# Altium schematic sheet oscillators.SchDoc
size A
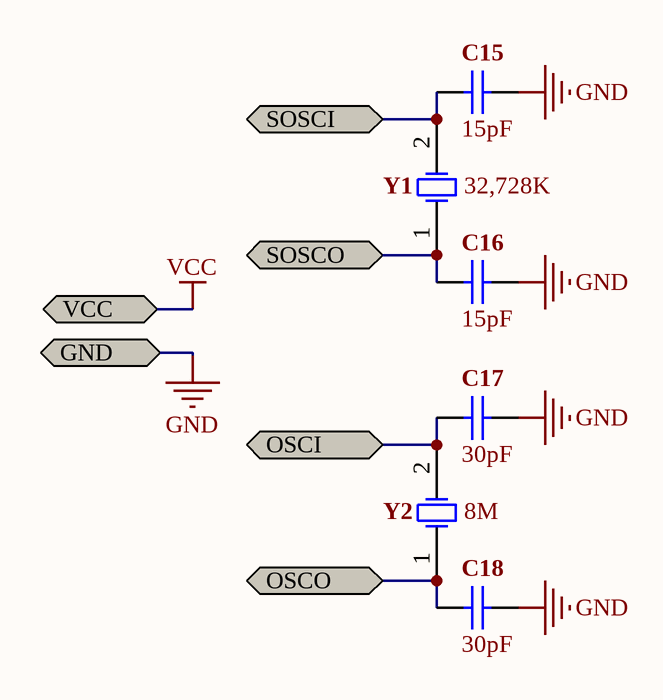
[diagram p0: oscillators.SchDoc]

## Parts
C15  value 15pF  [1608[0603]]  (hidden comment: Cap)
C16  value 15pF  [1608[0603]]  (hidden comment: Cap)
C17  value 30pF  [1608[0603]]  (hidden comment: Cap)
C18  value 30pF  [1608[0603]]  (hidden comment: Cap)
Y1  32,728K  [BCY-W2/D3.1]
Y2  8M  [49_SMD_8Mhz]

## Ports
GND, OSCI, OSCO, SOSCI, SOSCO, VCC

## Nets
GND: C15.1 C16.1 C17.1 C18.1 ; port GND
VCC: port VCC
OSCI: C17.2 Y2.2(OSC2) ; port OSCI
OSCO: C18.2 Y2.1(OSC1) ; port OSCO
SOSCI: C15.2 Y1.2(OSC2) ; port SOSCI
SOSCO: C16.2 Y1.1(OSC1) ; port SOSCO

## Library data of the parts
C15-C18 = Cap: Capacitor; Published: 8-Jun-2000; LatestRevisionDate: 17-Jul-2002; LatestRevisionNote: Re-released for DXP Platform.; PackageReference: RAD-0.3; Publisher: Altium Limited; PackageDescription: Radial Cap, Thru-Hole; 2 Leads; 0.3 in Pin Spacing
Y1 Y2 = XTAL_2PINS: Crystal Oscillator; buy: farnell:1701100; Published: 8-Jun-2000; LatestRevisionDate: 17-Jul-2002; LatestRevisionNote: Re-released for DXP Platform.; PackageReference: R38; Publisher: Altium Limited